# EAGLE design 7seg (EAGLE 7.2.0)
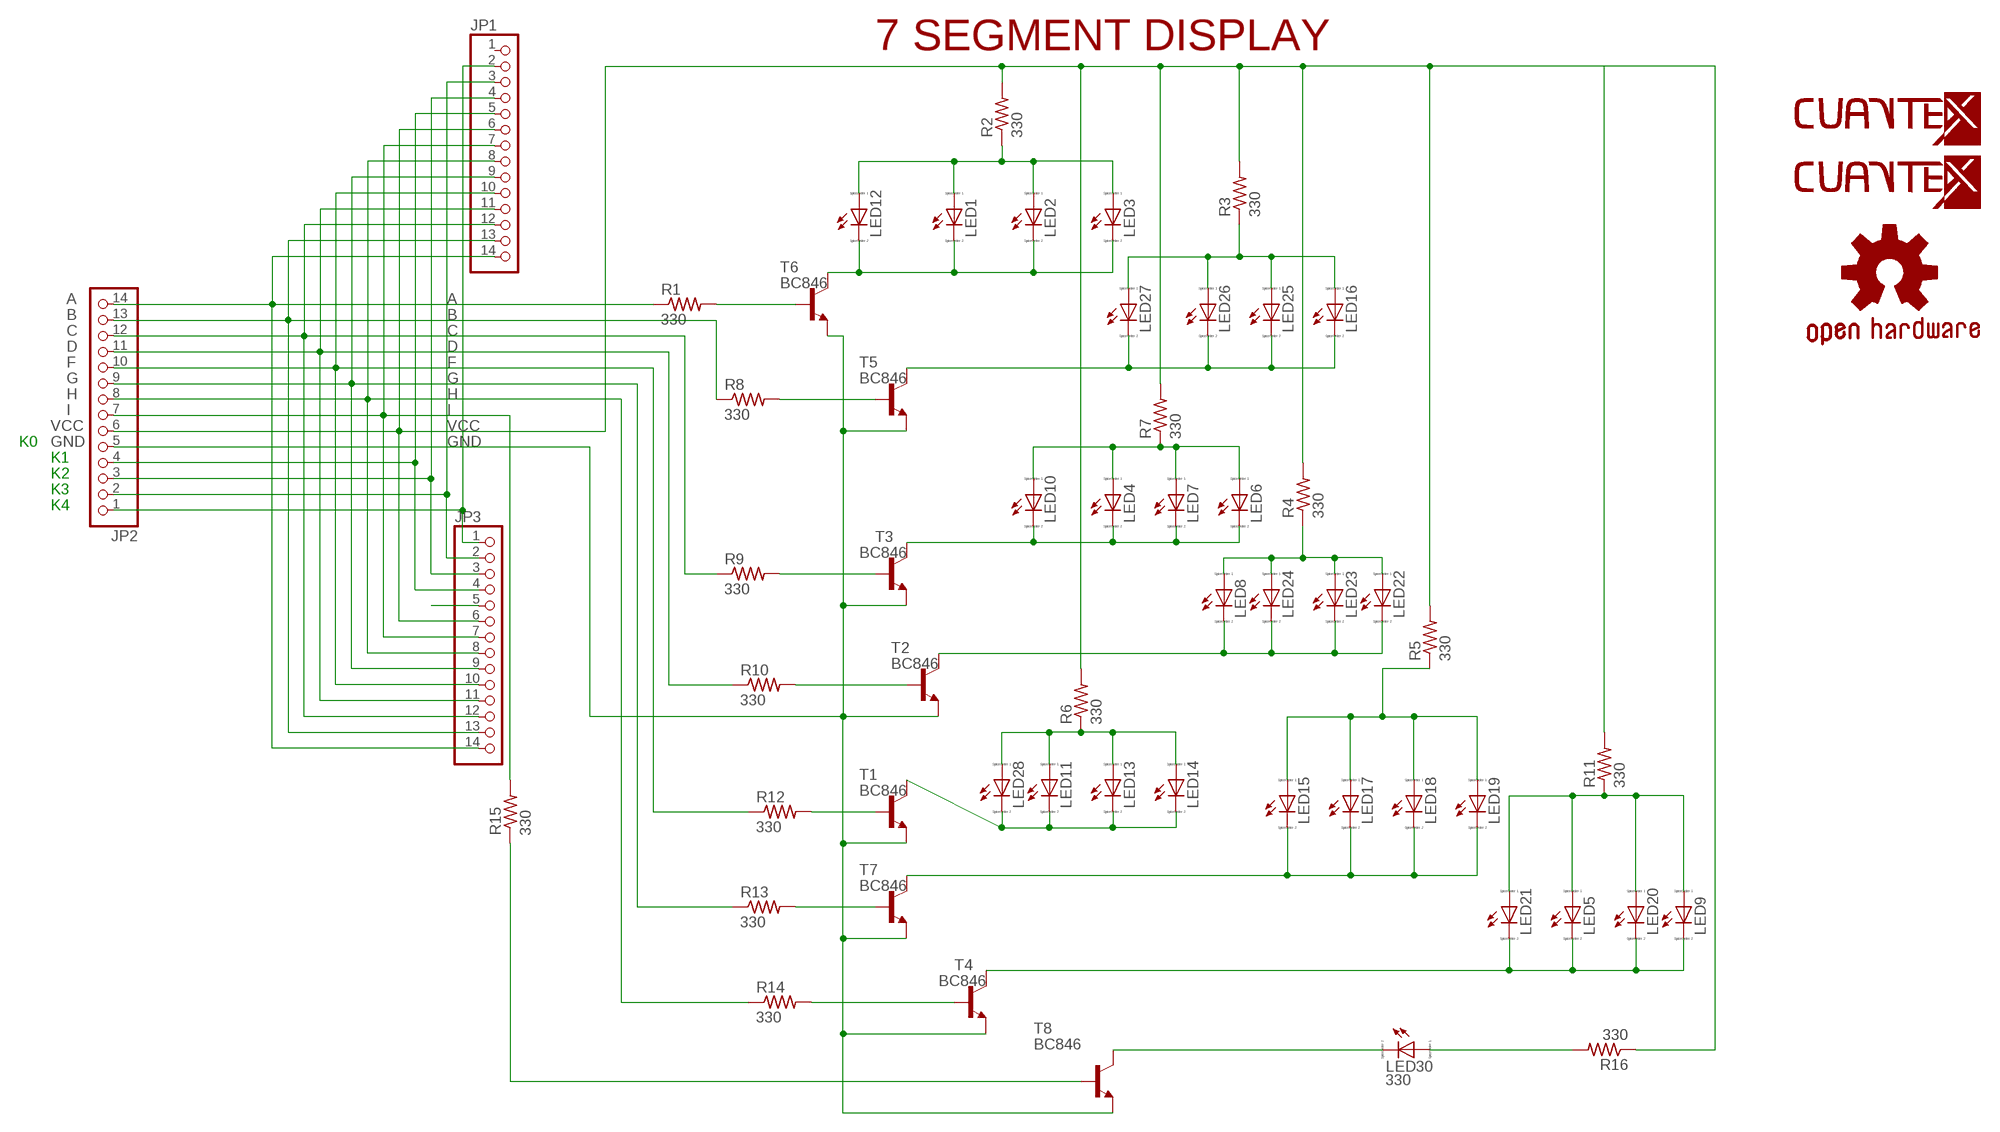
[diagram p0: schematic, sheet 1]

## Parts
GOLD_ORB_SM2  OSHWLOGO_GOLD_ORB_MED  [OSHW1]
JP1  PINHD-1X14  [1X14]
JP2  PINHD-1X14  [1X14]
JP3  PINHD-1X14  [1X14]
LED1  LED_E  [LED_1206]
LED2  LED_E  [LED_1206]
LED3  LED_E  [LED_1206]
LED4  LED_E  [LED_1206]
LED5  LED_E  [LED_1206]
LED6  LED_E  [LED_1206]
LED7  LED_E  [LED_1206]
LED8  LED_E  [LED_1206]
LED9  LED_E  [LED_1206]
LED10  LED_E  [LED_1206]
LED11  LED_E  [LED_1206]
LED12  LED_E  [LED_1206]
LED13  LED_E  [LED_1206]
LED14  LED_E  [LED_1206]
LED15  LED_E  [LED_1206]
LED16  LED_E  [LED_1206]
LED17  LED_E  [LED_1206]
LED18  LED_E  [LED_1206]
LED19  LED_E  [LED_1206]
LED20  LED_E  [LED_1206]
LED21  LED_E  [LED_1206]
LED22  LED_E  [LED_1206]
LED23  LED_E  [LED_1206]
LED24  LED_E  [LED_1206]
LED25  LED_E  [LED_1206]
LED26  LED_E  [LED_1206]
LED27  LED_E  [LED_1206]
LED28  LED_E  [LED_1206]
LED30  330  LED_E  [LED_1206]
R1  330  R-US_R0603  [R0603]
R2  330  R-US_R0603  [R0603]
R3  330  R-US_R0603  [R0603]
R4  330  R-US_R0603  [R0603]
R5  330  R-US_R0603  [R0603]
R6  330  R-US_R0603  [R0603]
R7  330  R-US_R0603  [R0603]
R8  330  R-US_R0603  [R0603]
R9  330  R-US_R0603  [R0603]
R10  330  R-US_R0603  [R0603]
R11  330  R-US_R0603  [R0603]
R12  330  R-US_R0603  [R0603]
R13  330  R-US_R0603  [R0603]
R14  330  R-US_R0603  [R0603]
R15  330  R-US_R0603  [R0603]
R16  330  R-US_R0603  [R0603]
T1  BC846  [SOT23]
T2  BC846  [SOT23]
T3  BC846  [SOT23]
T4  BC846  [SOT23]
T5  BC846  [SOT23]
T6  BC846  [SOT23]
T7  BC846  [SOT23]
T8  BC846  [SOT23]
U$1  LOGO-TOP-20MM  [C-0]
U$2  LOGO-BOT-60MM  [B-60]

## Nets
A: JP1.14 JP2.14 JP3.14 R1.1
B: JP1.13 JP2.13 JP3.13 R8.1
C: JP1.12 JP2.12 JP3.12 R9.1
D: JP1.11 JP2.11 JP3.11 R10.1
F: JP1.10 JP2.10 JP3.10 R12.1
G: JP1.9 JP2.9 JP3.9 R13.1
GND: JP2.5 JP3.5 T1.2(E) T2.2(E) T3.2(E) T4.2(E) T5.2(E) T6.2(E) T7.2(E) T8.2(E)
H: JP1.8 JP2.8 JP3.8 R14.1
I: JP1.7 JP2.7 JP3.7 R15.2
N$1: LED5.A LED9.A LED20.A LED21.A R11.1
N$2: LED8.C LED22.C LED23.C LED24.C T2.3(C)
N$3: LED16.A LED25.A LED26.A LED27.A R3.1
N$4: R12.2 T1.1(B)
N$5: LED11.C LED13.C LED14.C LED28.C T1.3(C)
N$6: LED15.A LED17.A LED18.A LED19.A R5.1
N$7: LED30.A R16.2
N$8: LED1.C LED2.C LED3.C LED12.C T6.3(C)
N$9: R1.2 T6.1(B)
N$10: R8.2 T5.1(B)
N$11: LED16.C LED25.C LED26.C LED27.C T5.3(C)
N$12: R15.1 T8.1(B)
N$13: R9.2 T3.1(B)
N$14: LED4.C LED6.C LED7.C LED10.C T3.3(C)
N$15: R10.2 T2.1(B)
N$16: LED30.C T8.3(C)
N$17: R13.2 T7.1(B)
N$18: LED15.C LED17.C LED18.C LED19.C T7.3(C)
N$20: R14.2 T4.1(B)
N$21: LED5.C LED9.C LED20.C LED21.C T4.3(C)
N$22: LED1.A LED2.A LED3.A LED12.A R2.1
N$23: LED8.A LED22.A LED23.A LED24.A R4.1
N$27: LED4.A LED6.A LED7.A LED10.A R7.1
N$29: LED11.A LED13.A LED14.A LED28.A R6.1
N$39: JP1.5 JP2.4 JP3.4
N$40: JP1.4 JP2.3 JP3.3
N$41: JP1.3 JP2.2 JP3.2
N$42: JP1.2 JP2.1 JP3.1
VCC: JP1.6 JP2.6 JP3.6 R2.2 R3.2 R4.2 R5.2 R6.2 R7.2 R11.2 R16.1
Unconnected: JP1.1

## Notes on the sheet
- 7 SEGMENT DISPLAY
- K0
- K1
- K2
- K3
- K4

## Library data of the parts
GOLD_ORB_SM2 = bfl:OSHWLOGO: These are Open-Source Hardware logos.
JP1-JP3 = pinhead:PINHD-1X14: PIN HEADER
LED1-LED28 LED30 = eagle-ltspice:LED_E: LED Source: http://www.osram.convergy.de Source: www.luxeon.com Source: www.kingbright.com; SPICEMODEL: NONE; SPICEPREFIX: D; SPICETYPE: diode
R1-R14 = resistor:R-US_: RESISTOR, American symbol
R15 R16 = rcl:R-US_: RESISTOR, American symbol
T1 = transistor:BC846: NPN TRANSISTOR
T2-T8 = transistor-neu-to92:BC846: NPN TRANSISTOR
U$1 = LOGOTIPOS:LOGO-TOP-20MM
U$2 = LOGOTIPOS:LOGO-BOT-60MM

## Board
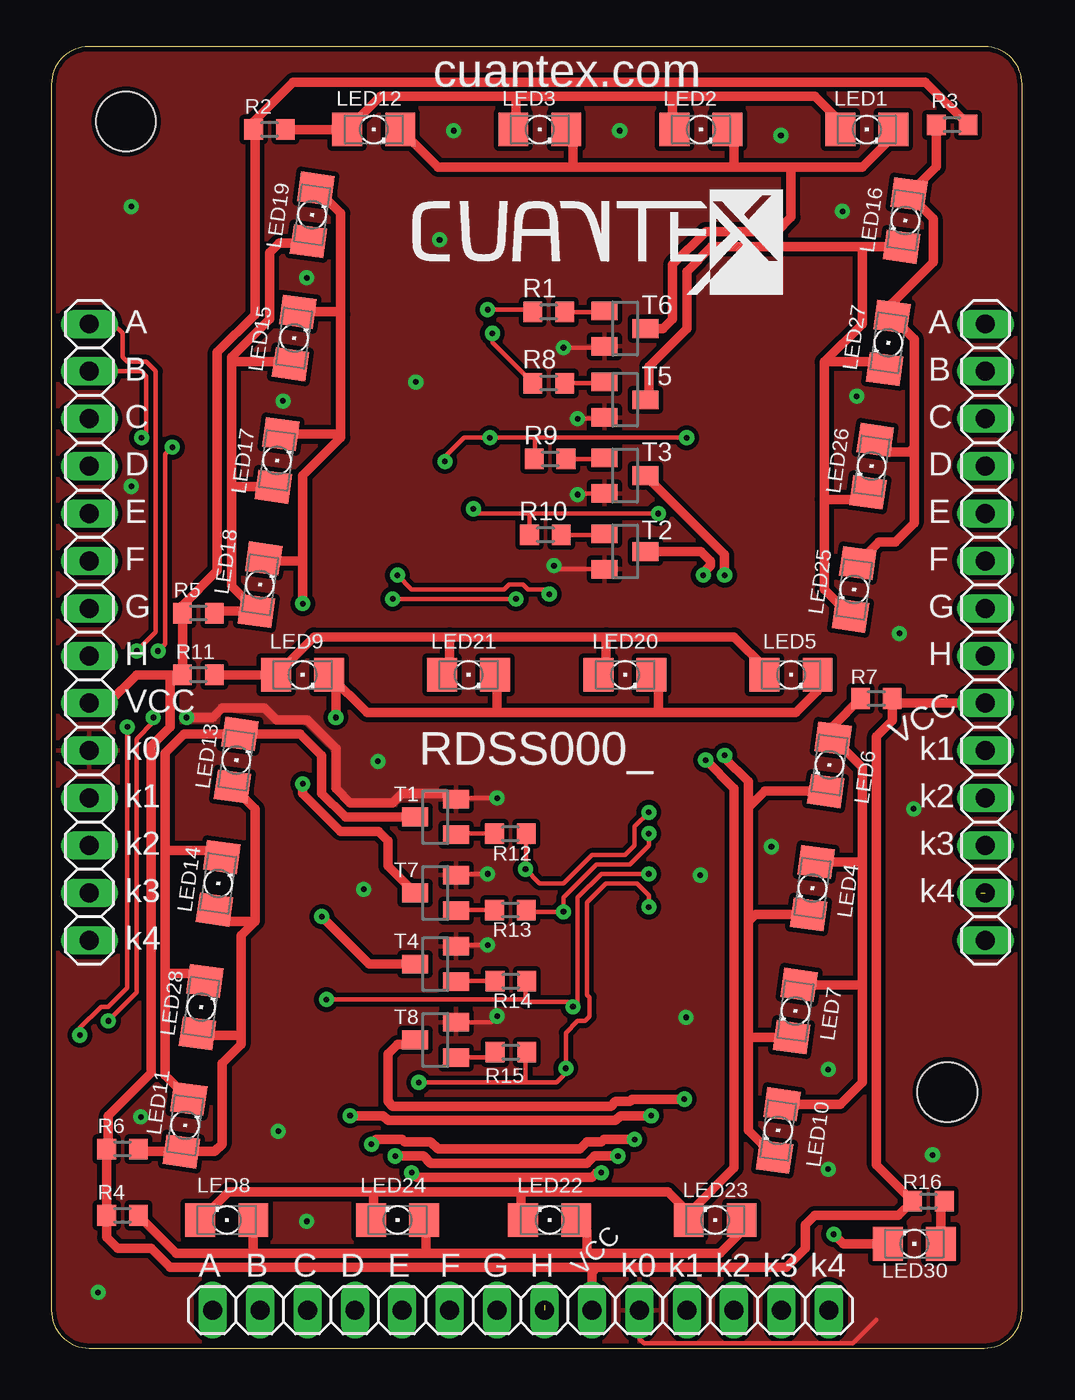
[diagram p1: board, top side]
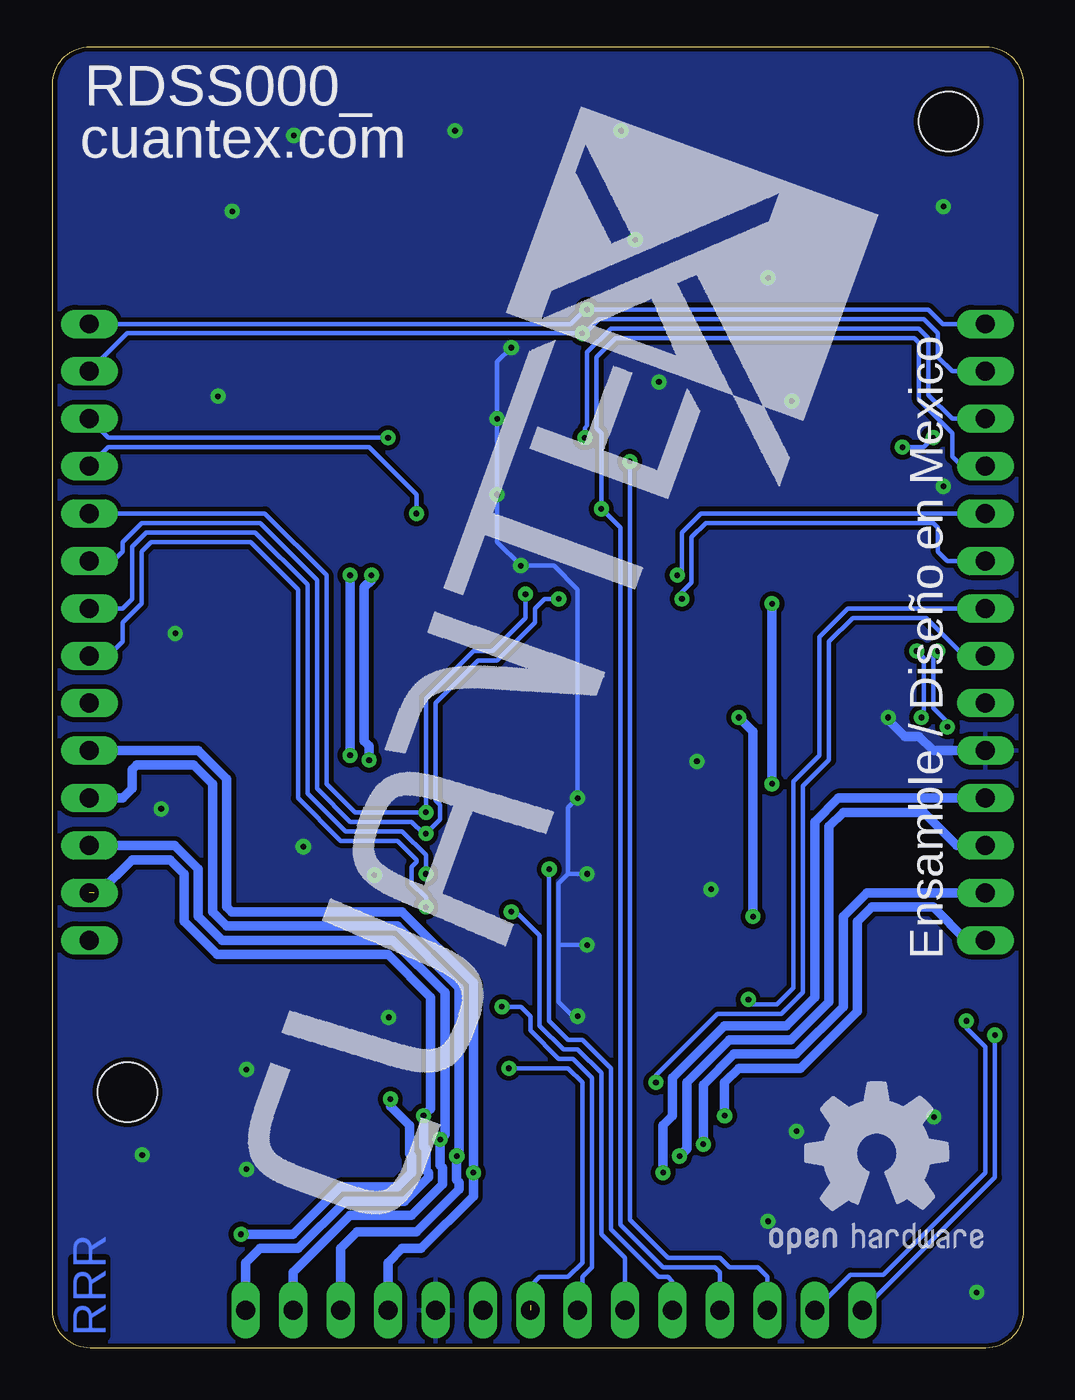
[diagram p2: board, bottom side, seen from below]

Size 52 x 69.71 mm. Coordinates in mm from the lower left corner, seen from the top.
Outline: 52,2.02 52,67.71 arc90 50,69.71 2,69.71 arc90 0,67.71 0,2.02 arc90 2.02,0 49.98,0 arc90 52,2.02
Copper layers (1*16): Top 0.035mm / dielectric 1.5mm / Bottom 0.035mm
Design rules "cuantex2layerdrc": minimum track width 8mil, minimum drill 0.3mm, track to track 8mil, track to pad 8mil, pad to pad 8mil, via to via 8mil, smd to smd 8mil, copper to edge 10mil, drill to drill 10mil, minimum pad ring 10mil, minimum via ring 10mil, stop-mask expansion 4mil, vias tented up to drill 0mil, thermal gap 10mil
Holes 3.2 mm at 4,65.71 48,13.71

### Footprints (pad centres in the part's own frame; a part is rotated, then mirrored left to right if it is on the bottom)
1X14 = drill 1.016 long: 1 -16.51,0; 2 -13.97,0; 3 -11.43,0; 4 -8.89,0; 5 -6.35,0; 6 -3.81,0; 7 -1.27,0; 8 1.27,0; 9 3.81,0; 10 6.35,0; 11 8.89,0; 12 11.43,0; 13 13.97,0; 14 16.51,0
LED_1206 = smd 1.6 x 1.803: A -1.422,0; C 1.422,0
R0603 = smd 1 x 1.1: 1 -0.85,0; 2 0.85,0
SOT23 = smd 1 x 1.4: 1 -0.95,-1.1; 2 0.95,-1.1; 3 0,1.1

### Placement (x,y rotation side)
GOLD_ORB_SM2  14.22,3.3 0 bottom
JP1  50.04,38.35 90 top
JP2  2.03,38.35 90 top
JP3  25.15,2.03 180 top
LED1  43.69,65.28 0 top
LED2  34.8,65.28 0 top
LED3  26.16,65.28 0 top
LED4  40.77,24.64 262 top
LED5  39.62,36.07 0 top
LED6  41.68,31.24 262 top
LED7  39.85,18.06 262 top
LED8  9.4,6.86 180 top
LED9  13.46,36.07 0 top
LED10  38.94,11.66 262 top
LED11  7.16,11.94 82 top
LED12  17.27,65.28 0 top
LED13  9.91,31.5 82 top
LED14  8.94,24.89 82 top
LED15  13,54.1 82 top
LED16  45.75,60.4 262 top
LED17  12.09,47.55 82 top
LED18  11.18,40.89 82 top
LED19  13.97,60.71 82 top
LED20  30.73,36.07 0 top
LED21  22.35,36.07 0 top
LED22  26.7,6.86 180 top
LED23  35.56,6.86 180 top
LED24  18.54,6.86 180 top
LED25  43,40.64 262 top
LED26  43.94,47.24 262 top
LED27  44.83,53.85 262 top
LED28  8.03,18.26 82 top
LED30  46.23,5.59 180 top
R1  26.64,55.5 0 top
R2  11.68,65.28 180 top
R3  48.26,65.53 0 top
R4  3.81,7.11 180 top
R5  7.87,39.37 180 top
R6  3.81,10.67 180 top
R7  44.2,34.8 0 top
R8  26.64,51.69 0 top
R9  26.72,47.62 0 top
R10  26.47,43.56 0 top
R11  7.87,36.07 180 top
R12  24.59,27.56 180 top
R13  24.59,23.47 180 top
R14  24.61,19.66 180 top
R15  24.61,15.85 0 top
R16  46.99,7.87 0 top
T1  20.57,28.45 90 top
T2  30.73,42.67 270 top
T3  30.73,46.74 270 top
T4  20.57,20.57 90 top
T5  30.73,50.8 270 top
T6  30.73,54.61 270 top
T7  20.57,24.38 90 top
T8  20.57,16.51 90 top
U$1  19.3,56.39 0 top
U$2  7.62,60.71 290 top

### Tracks (layer width: path | path; a pad name or v marks a point on that pad's centre or on a via)
A  (via drill 0.3)
  Top 0.254: v23.37,55.63 25.67,55.63 R1.1 | v4.06,33.27 4.06,19.3 3.05,18.29 2.67,18.29 1.52,17.14 v1.52,16.76 | v4.57,37.34 5.59,38.35 5.59,52.32 5.08,52.83 4.06,52.83 3.81,53.09 3.81,54.36 3.3,54.86 JP2.14
  Bottom 0.254: JP1.14 24.26,54.86 23.5,55.63 v23.37,55.63 5.08,55.63 4.32,54.86 JP2.14 | JP3.14 1.52,9.14 v1.52,16.76 | v4.06,33.27 4.06,33.53 4.83,34.29 4.83,37.08 v4.57,37.34
B  (via drill 0.3)
  Top 0.254: 25.8,51.93 R8.1 23.62,53.86 v23.62,54.36 | v3.05,17.53 4.57,19.05 4.57,32.64 5.46,33.53 v5.46,33.78 | v6.48,48.26 6.1,47.88 6.1,37.72 v5.71,37.34 | JP2.13 4.83,52.32 5.08,52.07 5.08,49.02 v4.83,48.77
  Bottom 0.254: JP1.13 48.01,54.36 v23.62,54.36 23.5,54.36 22.73,55.12 5.33,55.12 4.57,54.36 4.57,53.09 3.81,52.32 JP2.13 | JP3.13 9.27,3.94 7.49,3.94 2.03,9.4 2.03,16.13 3.05,17.14 v3.05,17.53 | v4.83,48.77 5.33,48.26 v6.48,48.26 | v5.71,37.34 5.33,36.96 5.33,33.91 v5.46,33.78
C  (via drill 0.3)
  Top 0.254: v34.04,48.77 25.91,48.77 | 25.91,48.77 v23.5,48.77 22.1,48.77 21.08,47.75 v21.08,47.5 | R9.1 25.91,47.66 25.91,48.77
  Bottom 0.254: v34.04,48.77 49.02,48.77 JP1.12 | v21.08,47.5 21.08,6.86 19.05,4.83 16.26,4.83 15.75,4.32 14.22,4.32 13.72,3.81 JP3.12 | JP2.12 3.81,49.78 5.08,51.05 5.08,54.1 5.59,54.61 22.1,54.61 23.37,53.34 23.37,49.4 23.5,49.28 v23.5,48.77
D  (via drill 0.3)
  Top 0.254: v32.51,44.7 25.65,44.7 | 25.65,44.7 22.86,44.7 v22.61,44.96 | R10.1 25.62,44.67 25.65,44.7
  Bottom 0.254: v32.51,44.7 32.51,45.72 35.05,48.26 49.02,48.26 JP1.11 | JP2.11 3.3,47.24 3.81,47.75 3.81,49.02 5.59,50.8 5.59,53.85 5.84,54.1 21.84,54.1 22.86,53.09 22.86,49.28 22.61,49.02 v22.61,44.96 21.59,43.94 21.59,6.6 19.3,4.32 16.51,4.32 16.26,4.06 JP3.11
F  (via drill 0.3)
  Top 0.254: R12.1 25.44,25.69 v25.4,25.65 26.16,24.89 27.43,24.89 28.96,26.42 30.73,26.42 31.24,26.92 31.24,27.94 v32,28.7 | v18.54,41.4 19.3,40.64 24.26,40.64 24.51,40.89 25.27,40.89 25.53,40.64 26.42,40.64 v26.67,40.39
  Bottom 0.254: JP2.10 17.27,44.7 18.29,43.69 18.29,41.66 v18.54,41.4 | JP1.10 40.64,44.7 37.34,41.4 37.34,30.23 35.81,28.7 v32,28.7 32,34.8 29.46,37.34 28.45,37.34 26.67,39.12 v26.67,40.39 | JP3.10 18.8,3.56 19.05,3.81 19.56,3.81 22.1,6.35 22.1,14.99 23.62,16.51 24.38,16.51 25.4,17.53 v25.4,25.65
G  (via drill 0.3)
  Top 0.254: v18.29,40.13 v24.89,40.13 | v32,27.56 32,26.92 30.99,25.91 29.21,25.91 27.43,24.13 v27.43,23.37 25.54,23.37 R13.1
  Bottom 0.254: JP2.9 4.06,42.16 4.57,42.67 4.57,43.94 4.83,44.2 17.02,44.2 17.78,43.43 17.78,41.02 18.29,40.51 v18.29,40.13 | JP1.9 48.77,42.16 48.26,42.67 48.26,43.18 47.24,44.2 40.89,44.2 37.85,41.15 37.85,29.97 36.07,28.19 32.77,28.19 32.13,27.56 v32,27.56 31.24,28.32 31.24,29.08 31.5,29.34 31.5,34.54 29.21,36.83 28.19,36.83 26.16,38.86 26.16,39.62 25.65,40.13 v24.89,40.13 | JP3.9 21.34,4.83 22.61,6.1 22.61,14.73 23.88,16 24.64,16 25.91,17.27 25.91,22.1 27.18,23.37 v27.43,23.37
GND  (via drill 0.3)
  Top 0.254: T6.2 29.57,53.59 v27.43,53.59 | T5.2 29.63,49.78 v28.19,49.78 | T1.2 21.74,29.46 v23.88,29.46 | T4.2 21.74,21.59 v23.37,21.59 | T7.2 21.74,25.4 v23.37,25.4 | v28.19,45.72 28.26,45.79 T3.2 | v23.88,17.78 23.56,17.46 T8.2 | v26.92,41.91 27.11,41.72 T2.2 | JP3.5 31.5,0.51 31.75,0.25 42.93,0.25 44.2,1.52
  Top 0.508: v7.24,33.78 8.64,33.78 9.14,34.29 11.43,34.29 12.06,33.66 13.72,33.66 15.24,32.13 15.24,29.97 16,29.21 18.29,29.21 18.8,29.72 21.08,29.72 21.4,29.4 T1.2
  Bottom 0.254: 24.38,25.4 24.38,28.96 v23.88,29.46 23.88,40.64 25.15,41.91 v26.92,41.91 28.19,43.18 v28.19,45.72 v28.19,49.78 28.19,52.83 v27.43,53.59 | v23.37,21.59 24.89,21.59 | v23.37,25.4 24.38,25.4 | 24.89,21.59 24.89,18.54 24.13,17.78 v23.88,17.78 | 24.89,21.59 24.89,24.89 24.38,25.4
  Bottom 0.508: JP2.5 4.83,32 5.59,32.77 6.35,32.77 7.24,33.66 v7.24,33.78
  other vias: 34,17.71 34.76,25.33 45.43,38.29 12.16,11.62 16.73,24.57 17.49,31.43 19.52,51.75 2.5,2.98 41.62,9.59 47.21,10.35 20.79,59.37 21.55,65.21 30.44,65.21 39.08,64.96 42.38,60.89 4.28,61.15 13.68,6.79 43.14,50.99 12.41,50.73 41.62,14.92 38.57,26.86 4.79,12.38 4.28,46.16 13.68,57.34 46.19,28.89
  pour Top (isolate 0.254): 0,69.71 52,69.71 52,-0.29 0,-0.29
  pour Bottom (isolate 0.254): 0,69.71 52,69.71 52,-0.29 0,-0.29
H  (via drill 0.3)
  Top 0.254: v32,25.4 29.46,25.4 28.19,24.13 28.19,18.54 v27.94,18.29 27.69,18.54 25.4,18.54 25.4,18.67 | R14.1 25.4,19.6 25.4,18.67 | v14.73,18.67 25.4,18.67
  Bottom 0.254: JP1.8 48.26,39.62 47.75,40.13 47.75,42.93 46.99,43.69 41.15,43.69 38.35,40.89 38.35,29.72 36.32,27.69 33.27,27.69 32,26.42 v32,25.4 | JP2.8 9.4,39.62 10.92,38.1 10.92,31.75 12.32,30.35 12.32,19.3 13.21,18.41 14.48,18.41 v14.73,18.67 14.61,18.54 | JP3.8 23.62,2.29 23.62,3.81 23.11,4.32 23.11,14.48 24.13,15.49 24.89,15.49 26.42,17.02 26.42,17.78 26.92,18.29 v27.94,18.29
I  (via drill 0.3)  (1 unrouted)
  Top 0.254: v19.68,14.22 25.4,14.22 | 25.4,14.22 27.05,14.22 27.56,14.73 v27.56,14.99 27.56,16.89 28.19,17.53 28.57,17.53 28.83,17.78 28.83,18.8 28.7,18.92 28.7,23.88 29.72,24.89 31.37,24.89 32,24.26 v32,23.62 | R15.2 25.4,15.79 25.4,14.22
  Bottom 0.254: JP1.7 49.02,37.08 48.26,37.85 48.26,38.86 47.24,39.88 47.24,42.67 46.74,43.18 41.4,43.18 38.86,40.64 38.86,29.46 36.58,27.18 33.53,27.18 32.51,26.16 32.51,26.04 32.77,25.78 32.77,24.89 32,24.13 v32,23.62 | JP2.7 3.17,37.08 5.21,39.12 9.14,39.12 10.41,37.85 10.41,31.5 11.81,30.1 11.81,19.05 12.95,17.91 16.38,17.91 19.68,14.6 v19.68,14.22 | 26.42,2.29 26.42,3.3 25.91,3.81 24.38,3.81 23.62,4.57 23.62,14.22 24.38,14.99 v27.56,14.99
N$1
  Top 0.508: 21.34,38.1 14.07,38.1 LED9.A R11.1 | 21.34,38.1 29.72,38.1 | 29.72,38.1 36.58,38.1 38.2,36.47 LED5.A | LED21.A 21.34,36.47 21.34,38.1 | LED20.A 29.72,36.47 29.72,38.1
N$2  (via drill 0.3)
  Top 0.508: 34.29,7.37 36.58,9.65 36.58,29.97 v35.05,31.5 | 34.29,7.37 34.14,7.21 LED23.C | LED8.C 9.5,8.38 17.27,8.38 | 17.27,8.38 25.15,8.38 | 25.15,8.38 33.02,8.38 34.04,7.37 34.29,7.37 | LED22.C 25.15,6.99 25.15,8.38 | LED24.C 17.27,7.01 17.27,8.38 | T2.3 34.8,42.67 35.31,42.16 35.31,41.91 34.92,41.53 v34.92,41.4
  Bottom 0.508: v35.05,31.5 35.05,32.26 35.31,32.51 35.31,40.77 34.92,41.15 v34.92,41.4
N$3
  Top 0.508: R3.1 47.41,63.28 LED16.A 47.24,60.51 47.24,58.17 45.03,55.95 LED27.A 46.23,54.06 46.23,48.26 | LED26.A 44.79,48.01 45.97,48.01 46.23,48.26 | 46.23,48.26 46.23,44.2 45.21,43.18 44.33,43.18 LED25.A
N$4
  Top 0.254: T1.1 21.73,27.56 R12.2
N$5
  Top 0.508: 6.1,26.67 6.1,31.88 7.12,32.9 LED13.C 13.32,32.9 14.48,31.75 14.48,29.72 15.75,28.45 T1.3 | 6.1,26.67 6.1,20.07 | 6.1,20.07 6.1,14.61 LED11.C | LED14.C 8.77,26.67 6.1,26.67 | LED28.C 7.83,20.07 6.1,20.07
N$6
  Top 0.508: R5.1 8.84,39.49 LED18.A 9.65,40.81 9.65,46.23 | 9.65,46.23 9.65,53.09 | LED15.A 12.81,52.73 12.7,52.83 9.91,52.83 9.65,53.09 | LED17.A 9.74,46.14 9.65,46.23 | 9.65,53.09 11.68,55.12 11.68,58.67 12.19,59.18 13.66,59.18 LED19.A
N$7
  Top 0.254: R16.2 47.75,7.87
  Top 0.508: 47.75,7.87 47.65,7.77 LED30.A
N$8
  Top 0.508: LED12.C 20.73,63.25 27.94,63.25 | 27.94,63.25 36.58,63.25 | 36.58,63.25 39.62,63.25 | 39.62,63.25 43.43,63.25 45.11,64.92 LED1.C | LED3.C 27.94,64.92 27.94,63.25 | LED2.C 36.58,64.92 36.58,63.25 | 39.62,63.25 39.62,60.58 38.86,59.82 35.05,59.82 33.27,58.04 33.27,55.12 32.77,54.61 T6.3
N$9
  Top 0.254: T6.1 29.57,55.5 R1.2
N$10
  Top 0.254: T5.1 29.57,51.69 R8.2
N$11
  Top 0.508: 41.4,52.83 41.4,45.47 | 41.4,45.47 41.4,40.63 LED25.C | LED26.C 43.37,45.47 41.4,45.47 | LED27.C 44.24,52.83 41.4,52.83 | 43.43,58.99 LED16.C | 41.4,52.83 43.43,54.86 43.43,58.99 | T5.3 32,50.97 32,52.58 34.04,54.61 34.04,57.66 35.37,58.99 43.43,58.99
N$12
  Top 0.254: T8.1 23.47,15.56 R15.1
N$13
  Top 0.254: T3.1 29.57,47.62 R9.2
N$14  (via drill 0.3)
  Top 0.508: LED6.C 38.22,29.83 37.34,28.96 | 37.34,28.96 37.34,22.86 | 37.34,22.86 37.34,16.76 | 37.34,16.76 37.34,11.65 LED10.C | LED4.C 37.71,23.23 37.34,22.86 | LED7.C 37.45,16.65 37.34,16.76 | T3.3 36.07,42.5 v36.07,41.4 | 37.34,28.96 37.34,30.35 36.07,31.62 v36.07,31.75
  Bottom 0.508: v36.07,41.4 v36.07,31.75
N$15
  Top 0.254: T2.1 29.57,43.56 R10.2
N$16  (via drill 0.3)
  Top 0.508: v41.91,6.1 42.42,5.59 LED30.C | 19.22,16.51 T8.3 19.22,16.26 18.54,16.26 18.03,15.75 18.03,13.21 18.29,12.95 29.97,12.95 30.23,13.21 30.99,13.21 31.11,13.34 v33.91,13.34
  Bottom 0.508: v41.91,6.1 39.12,6.1 36.58,8.64 33.53,8.64 32.77,9.4 32.77,10.29 32.89,10.41 32.89,11.94 33.91,12.95 v33.91,13.34
N$17
  Top 0.254: T7.1 21.71,23.47 R13.2
N$18  (via drill 0.3)
  Top 0.508: 15.49,48.77 15.49,55.37 | 15.49,55.37 15.49,60.79 LED19.C | LED17.C 15.3,48.96 15.49,48.77 | LED15.C 15.36,55.51 15.49,55.37 | 13.46,40.21 v13.46,39.88 13.46,42.16 | T7.3 18.03,25.82 18.03,27.18 17.53,27.69 15.49,27.69 13.46,29.72 v13.46,30.23 | 15.49,48.77 13.46,46.74 13.46,42.16 | LED18.C 11.51,42.16 13.46,42.16
  Bottom 0.508: v13.46,30.23 v13.46,39.88
N$20
  Top 0.254: T4.1 21.71,19.66 R14.2
N$21  (via drill 0.3)
  Top 0.508: 23.88,34.04 16.92,34.04 LED9.C 15.24,35.71 v15.24,33.78 | 23.88,34.04 32.51,34.04 | 32.51,34.04 39.88,34.04 41.05,35.2 LED5.C | LED20.C 32.41,35.81 32.51,35.81 32.51,34.04 | LED21.C 23.88,35.97 23.88,34.04 | v14.48,23.11 17.02,20.57 T4.3
  Bottom 0.508: v14.48,23.11 14.48,33.02 v15.24,33.78
N$22
  Top 0.508: R2.1 LED12.A 17.63,67.06 24.89,67.06 | 24.89,67.06 33.27,67.06 | 33.27,67.06 40.89,67.06 42.27,65.68 LED1.A | LED3.A 24.89,65.43 24.89,67.06 | LED2.A 33.27,65.38 33.27,67.06
N$23
  Top 0.508: 10.92,5.08 6.69,5.08 R4.1 | 10.92,5.08 20.07,5.08 | 20.07,5.08 28.7,5.08 | 28.7,5.08 35.81,5.08 36.98,6.25 LED23.A | LED24.A 20.07,6.76 20.07,5.08 | LED22.A 28.7,6.27 28.7,5.08 | LED8.A 10.82,5.18 10.92,5.08
N$27
  Top 0.508: R7.1 41.88,33.33 LED6.A 43.43,31.09 43.43,26.16 | 43.43,26.16 43.43,19.3 | 43.43,19.3 43.43,14.22 42.28,13.07 LED10.A | LED4.A 43.32,26.05 43.43,26.16 | LED7.A 43.27,19.47 43.43,19.3
N$29
  Top 0.508: LED13.A 10.92,28.87 10.92,22.86 | 7.1,10.67 LED11.A | R6.1 4.8,10.53 LED11.A | LED14.A 9.37,22.86 10.92,22.86 | 10.92,22.86 10.16,22.1 10.16,16.76 | 10.16,16.76 10.16,16.26 9.14,15.24 9.14,10.92 8.75,10.53 LED11.A | LED28.A 7.92,16.76 10.16,16.76
N$39  (via drill 0.3)
  Top 0.508: v19.3,9.4 19.56,9.14 28.96,9.14 29.21,9.4 v29.46,9.4
  Bottom 0.508: JP1.5 44.2,32 42.67,30.48 42.67,23.62 42.42,23.37 33.27,23.37 29.46,19.56 v29.46,9.4 29.46,8.13 32.26,5.33 33.27,5.33 34.04,4.57 JP3.4 | JP2.4 9.91,29.46 11.18,28.19 11.18,18.8 12.7,17.27 16,17.27 18.8,14.48 18.8,12.45 19.3,11.94 v19.3,9.4
N$40  (via drill 0.3)
  Top 0.508: v18.41,10.29 19.94,10.29 20.32,9.91 28.7,9.91 29.08,10.29 v30.35,10.29
  Bottom 0.508: JP1.4 48.26,29.46 47.75,29.97 47.75,30.99 47.5,31.24 44.45,31.24 43.43,30.23 43.43,23.37 42.67,22.61 33.53,22.61 30.23,19.3 30.23,10.41 v30.35,10.29 30.35,9.02 30.23,8.89 30.23,8.51 32.51,6.22 35.69,6.22 36.58,5.33 JP3.3 | JP2.3 3.56,26.92 5.33,28.7 9.65,28.7 10.41,27.94 10.41,18.54 12.45,16.51 15.75,16.51 18.03,14.22 18.03,10.67 v18.41,10.29
N$41  (via drill 0.3)
  Top 0.508: v17.14,10.92 17.4,11.18 18.8,11.18 18.92,11.05 20.32,11.05 20.7,10.67 28.32,10.67 28.7,11.05 29.46,11.05 29.59,11.18 v31.24,11.18
  Bottom 0.508: JP2.2 8.38,24.38 9.65,23.11 9.65,18.29 12.19,15.75 15.49,15.75 17.14,14.1 v17.14,10.92 | JP1.3 45.47,26.92 44.2,25.65 44.2,23.11 42.93,21.84 33.78,21.84 30.99,19.05 30.99,11.43 v31.24,11.18 31.24,9.78 31.11,9.65 31.11,8.76 32.77,7.11 36.07,7.11 39.12,4.06 JP3.2
N$42  (via drill 0.3)  (1 unrouted)
  Top 0.508: v16,12.45 17.78,12.45 18.03,12.19 30.23,12.19 30.48,12.45 v32.13,12.45
  Bottom 0.508: JP2.1 3.05,21.84 4.83,23.62 8.13,23.62 8.89,22.86 8.89,18.03 11.94,14.99 15.24,14.99 16,14.22 v16,12.45 | 49.78,24.38 49.53,24.38 47.75,26.16 45.72,26.16 44.96,25.4 44.96,22.86 43.18,21.08 34.04,21.08 31.75,18.8 31.75,12.83 v32.13,12.45 32.13,10.79 32,10.67 32,9.53 31.88,9.4 31.88,9.14 33.15,7.87 36.32,7.87 38.86,5.33 40.89,5.33 41.66,4.57 JP3.1
VCC
  Top 0.508: R3.2 46.82,67.82 12.95,67.82 10.83,65.7 R2.2 10.92,65.19 10.92,55.37 8.89,53.34 8.89,41.66 7.02,39.79 R5.2 R11.2 6.35,36.07 | JP1.6 45.3,34.54 R7.2 45.05,33.62 44.2,32.77 44.2,9.82 R16.1 45.38,7.11 40.89,7.11 40.39,6.6 40.39,5.33 39.37,4.32 29.21,4.32 | JP2.6 3.05,34.54 4.57,36.07 6.35,36.07 | 6.35,36.07 6.35,33.27 5.33,32.26 5.33,14.73 3.05,12.45 3.05,10.76 R6.2 R4.2 2.96,5.93 3.56,5.33 5.33,5.33 6.35,4.32 29.21,4.32 | JP3.6 28.96,4.06 29.21,4.32

### Text on the board
Bottom: RRR
tPlace: cuantex.com | RDSS000_
bPlace: RDSS000_ | cuantex.com | Ensamble / Diseño en Mexico
tNames: A | A | B | B | C | C | D | D | E | E | F | F | G | G | H | H | VCC | VCC | k0 | k1 | k1 | k2 | k2 | k3 | k3 | k4 | k4 | A | B | C | D | E | F | G | H | VCC | k0 | k1 | k2 | k3 | k4